# EAGLE design VideoMacPac_adapter (EAGLE 6.5.0)
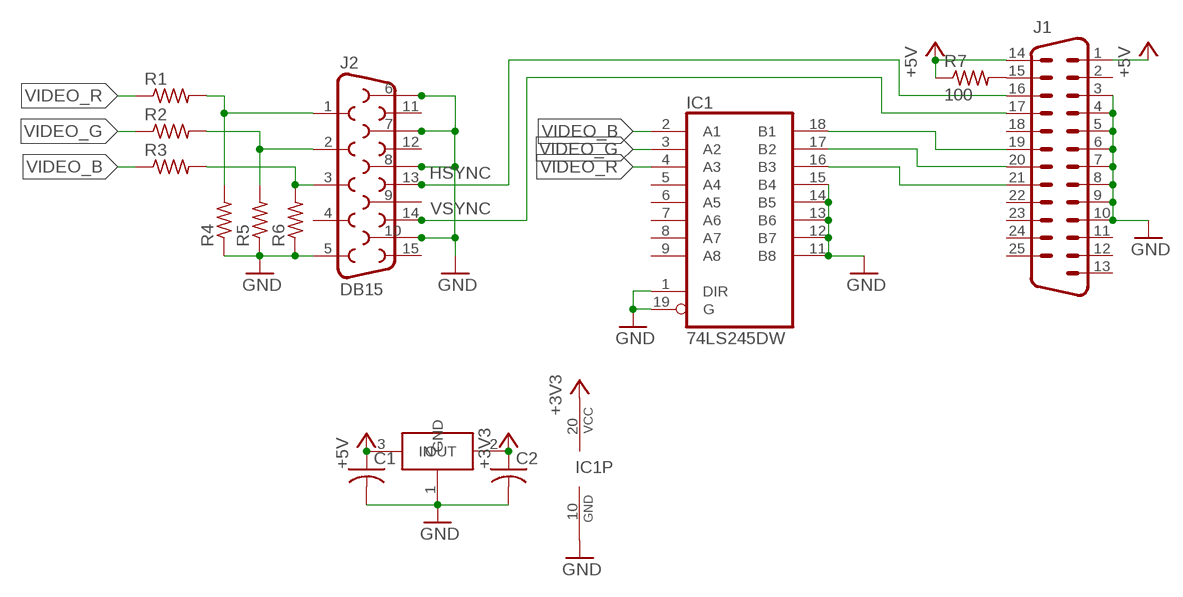
[diagram p0: schematic, sheet 1]

## Parts
C1  C-USC0603  [C0603]
C2  C-USC0603  [C0603]
IC1  74LS245DW  [SO20W]
IC2  MCP1700  [SOT23]
J1  DB25H  [M25H]
J2  DB15  [DB15]
R1  R-US_R0603  [R0603]
R2  R-US_R0603  [R0603]
R3  R-US_R0603  [R0603]
R4  R-US_R0603  [R0603]
R5  R-US_R0603  [R0603]
R6  R-US_R0603  [R0603]
R7  100  R-US_R0603  [R0603]

## Nets
+3V3: C2.1 IC1.20(VCC) IC2.2(OUT)
+5V: C1.1 IC2.3(IN) J1.1 J1.14 R7.1
GND: C1.2 C2.2 IC1.1(DIR) IC1.10(GND) IC1.11(B8) IC1.12(B7) IC1.13(B6) IC1.14(B5) IC1.15(B4) IC1.19(G) IC2.1(GND) J1.3 J1.4 J1.5 J1.6 J1.7 J1.8 J1.9 J1.10 J2.5 J2.6 J2.7 J2.8 J2.10 R4.1 R5.1 R6.1
HSYNC: J1.16 J2.13
N$1: J1.15 R7.2
N$2: IC1.16(B3) J1.21
N$3: J2.3 R3.2 R6.2
N$5: IC1.17(B2) J1.20
N$6: J2.2 R2.2 R5.2
N$7: J2.1 R1.2 R4.2
N$9: IC1.18(B1) J1.19
VIDEO_B: IC1.2(A1) R3.1
VIDEO_G: IC1.3(A2) R2.1
VIDEO_R: IC1.4(A3) R1.1
VSYNC: J1.17 J2.14
Unconnected: IC1.5(A4) IC1.6(A5) IC1.7(A6) IC1.8(A7) IC1.9(A8) J1.2 J1.11 J1.12 J1.13 J1.18 J1.22 J1.23 J1.24 J1.25 J2.4 J2.9 J2.11 J2.12 J2.15

## Library data of the parts
C1 C2 = resistor:C-US: CAPACITOR, American symbol
IC1 = 74xx-us:74*245: Octal BUS TRANSCEIVER, 3-state
IC2 = custom:MCP1700
J1 = SparkFun-Connectors:DB25: Various DB25 connectors
J2 = SparkFun-Connectors:DB15: DB15 / VGA right angle through-hole female connector.
R1-R7 = resistor:R-US_: RESISTOR, American symbol

## Board
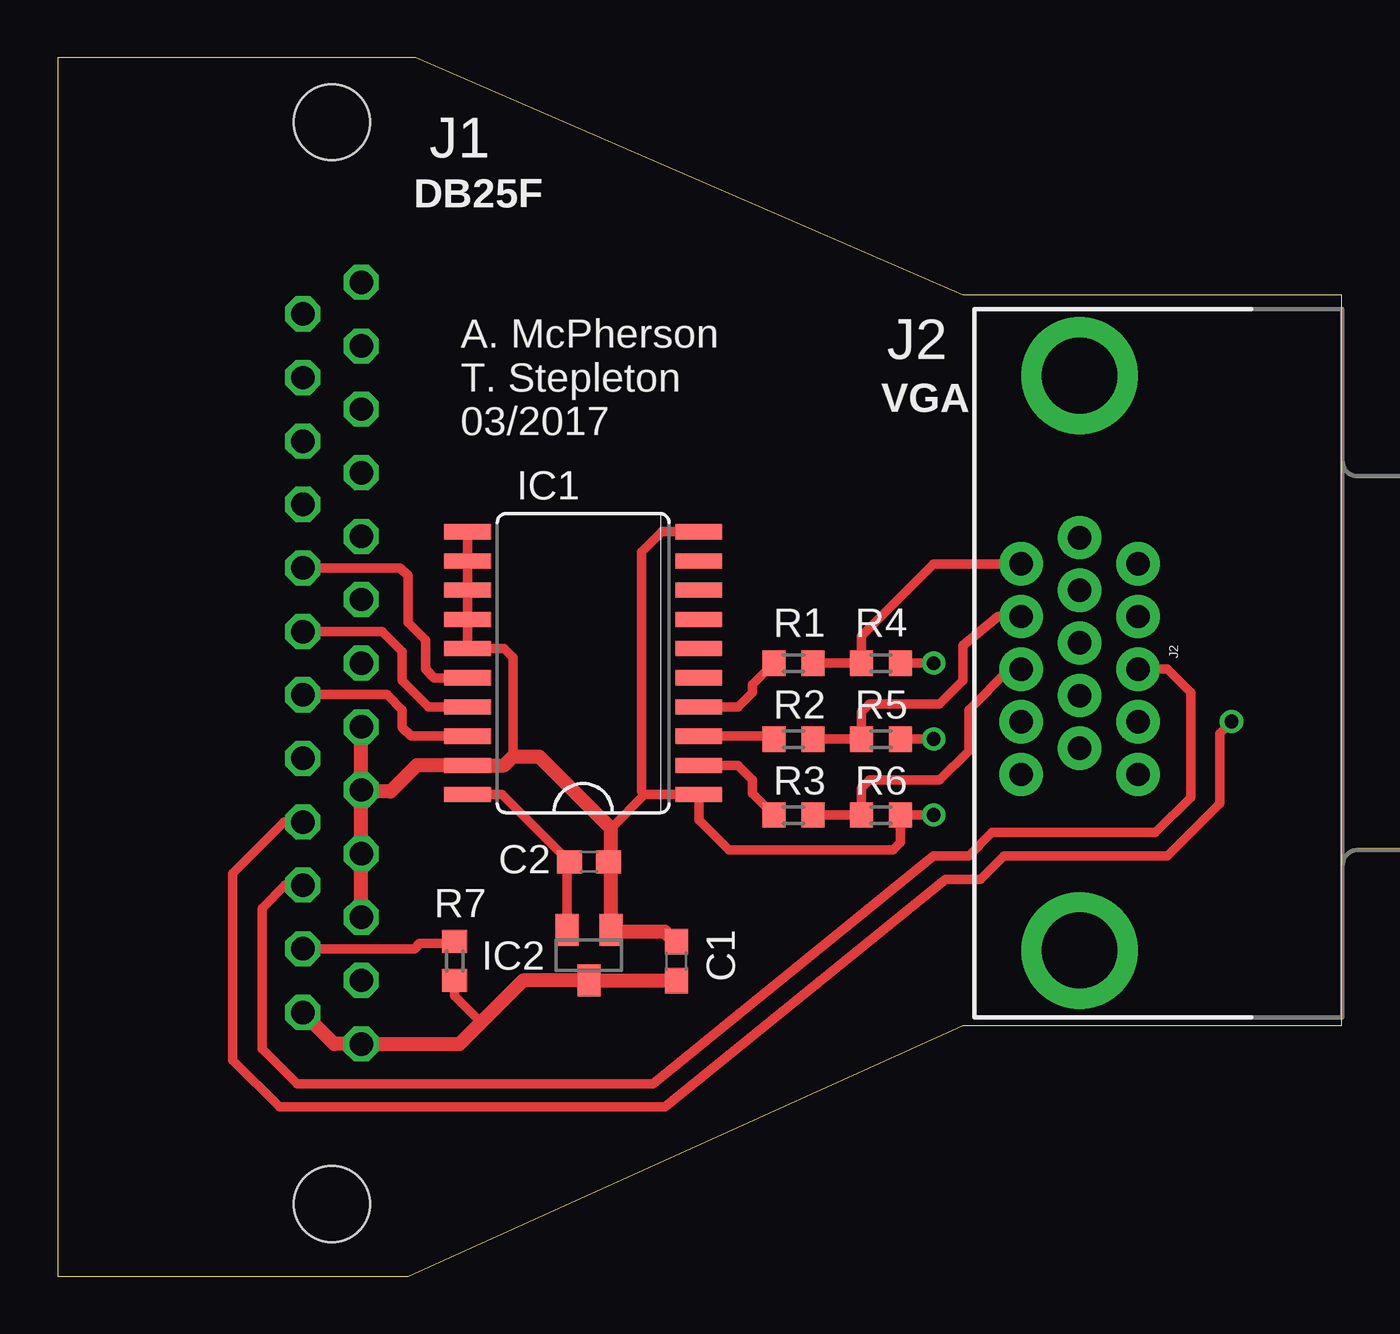
[diagram p1: board, top side]
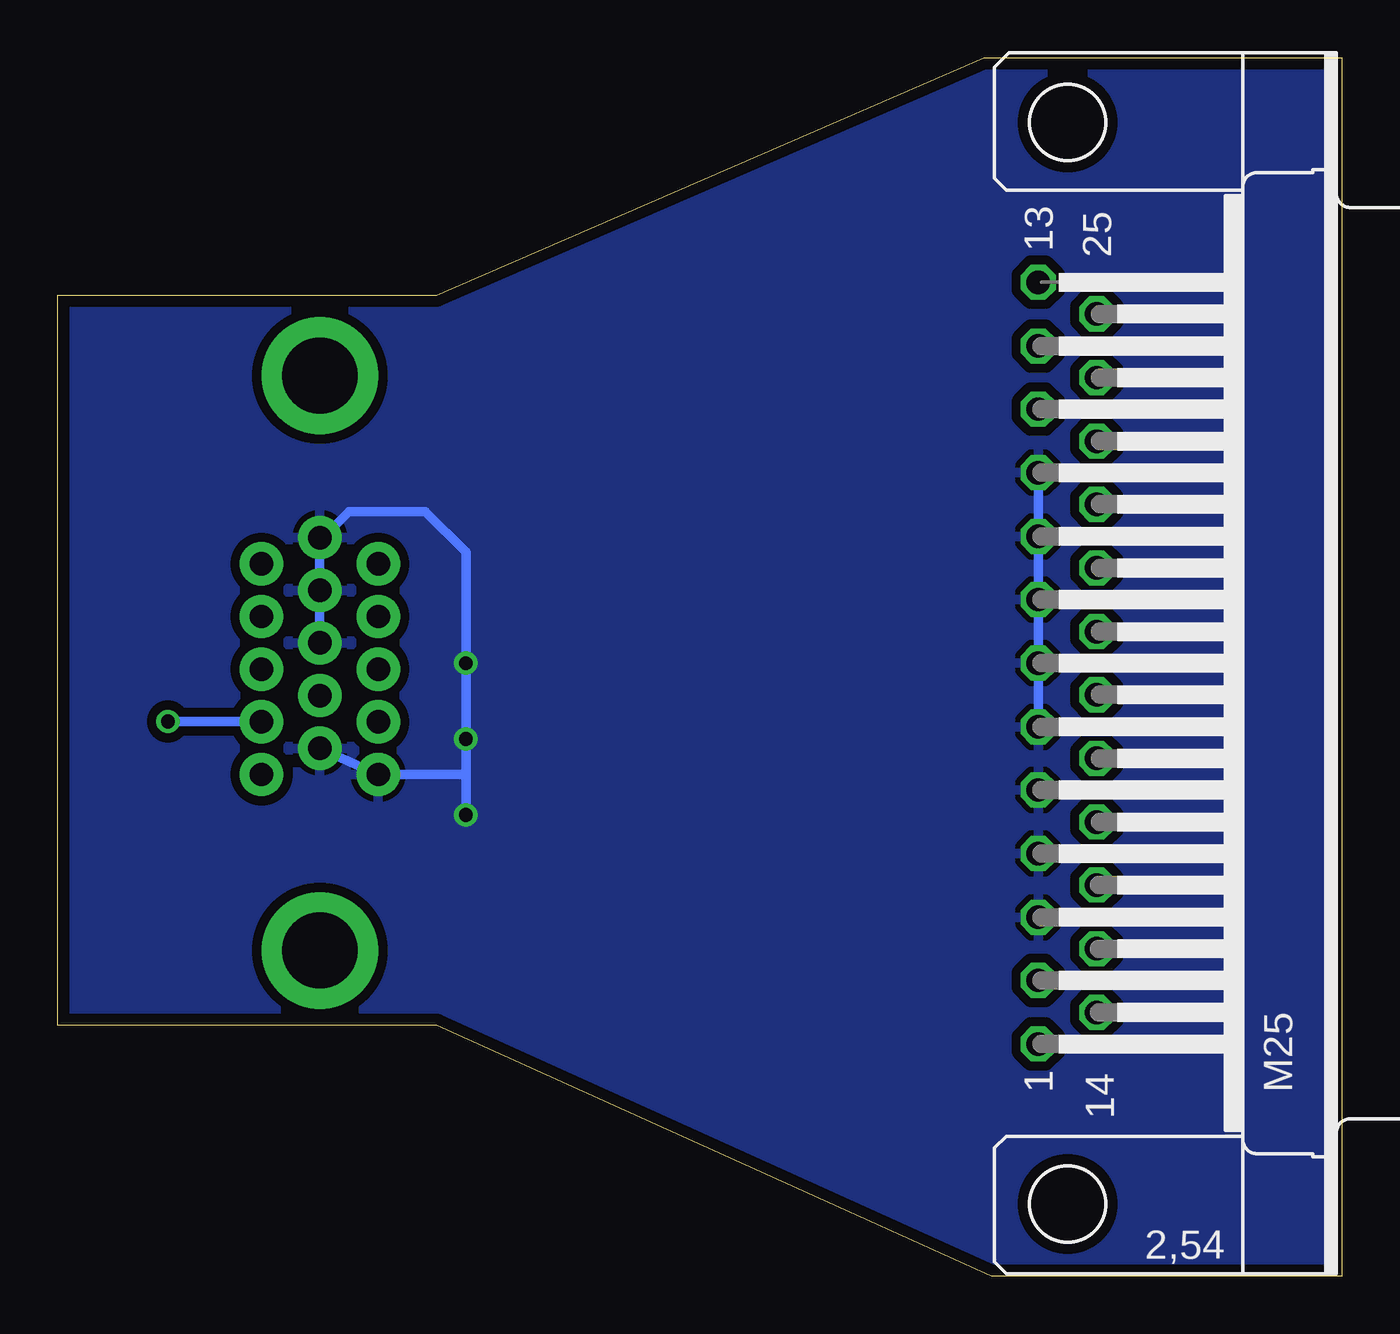
[diagram p2: board, bottom side, seen from below]

Size 55.86 x 53.01 mm. Coordinates in mm from the lower left corner, seen from the top.
Outline: 0,0 15.24,0 39.37,10.92 55.86,10.92 55.86,42.67 39.37,42.67 15.57,53.01 0,53.01 0,0
Copper layers (1*16): Top 0.035mm / dielectric 1.5mm / Bottom 0.035mm
Design rules "default *": minimum track width 10mil, minimum drill 23mil, track to track 10mil, track to pad 10mil, pad to pad 10mil, via to via 10mil, smd to smd 0mil, copper to edge 20mil, drill to drill 8mil, minimum pad ring 10mil, minimum via ring 8mil, stop-mask expansion 4mil, vias tented up to drill 0mil, thermal gap 10mil

### Footprints (pad centres in the part's own frame; a part is rotated, then mirrored left to right if it is on the bottom)
C0603 = smd 1.1 x 1: 1 -0.85,0; 2 0.85,0
SO20W = smd 0.66 x 2.032: 1 -5.715,-5.029; 2 -4.445,-5.029; 3 -3.175,-5.029; 4 -1.905,-5.029; 5 -0.635,-5.029; 6 0.635,-5.029; 7 1.905,-5.029; 8 3.175,-5.029; 9 4.445,-5.029; 10 5.715,-5.029; 11 5.715,5.029; 12 4.445,5.029; 13 3.175,5.029; 14 1.905,5.029; 15 0.635,5.029; 16 -0.635,5.029; 17 -1.905,5.029; 18 -3.175,5.029; 19 -4.445,5.029; 20 -5.715,5.029
SOT23 = smd 1 x 1.4: 1 -0.95,-1.1; 2 0.95,-1.1; 3 0,1.1
M25H = drill 1.016 octagon: 1 -16.561,1.27; 2 -13.792,1.27; 3 -11.049,1.27; 4 -8.28,1.27; 5 -5.512,1.27; 6 -2.769,1.27; 7 0,1.27; 8 2.769,1.27; 9 5.512,1.27; 10 8.28,1.27; 11 11.049,1.27; 12 13.792,1.27; 13 16.561,1.27; 14 -15.189,-1.27; 15 -12.421,-1.27; 16 -9.652,-1.27; 17 -6.909,-1.27; 18 -4.14,-1.27; 19 -1.372,-1.27; 20 1.372,-1.27; 21 4.14,-1.27; 22 6.909,-1.27; 23 9.652,-1.27; 24 12.421,-1.27; 25 15.189,-1.27 | hole 3.302: 23.52,0; -23.52,0
DB15 = drill 1.016 pad 1.88: 1 -4.32,-7.62; 2 -2.03,-7.62; 3 0.26,-7.62; 4 2.55,-7.62; 5 4.84,-7.62; 6 -5.46,-5.08; 7 -3.17,-5.08; 8 -0.88,-5.08; 9 1.41,-5.08; 10 3.7,-5.08; 11 -4.32,-2.54; 12 -2.03,-2.54; 13 0.26,-2.54; 14 2.55,-2.54; 15 4.84,-2.54 | drill 3.302 pad 5.08: G1 -12.5,-5.08; G2 12.5,-5.08
R0603 = smd 1 x 1.1: 1 -0.85,0; 2 0.85,0

### Placement (x,y rotation side)
C1  26.92,13.72 90 top
C2  23.11,18.03 0 top
IC1  22.86,26.67 90 top
IC2  23.11,13.97 180 top
J1  11.94,26.67 90 bottom
J2  49.53,26.67 270 top
R1  32,26.67 0 top
R2  32,23.37 0 top
R3  32,20.07 0 top
R4  35.81,26.67 180 top
R5  35.81,23.37 180 top
R6  35.81,20.07 180 top
R7  17.27,13.72 90 top

### Tracks (layer width: path | path; a pad name or v marks a point on that pad's centre or on a via)
+3V3
  Top 0.406: IC1.20 19.34,20.95 C2.1 22.16,17.93 IC2.2
+5V
  Top 0.406: C1.1 | R7.1 17.27,12.19 18.41,11.05
  Top 0.61: C1.1 IC2.3 20.24,12.87 18.41,11.05 17.48,10.11 J1.1 12.04,10.11 J1.14
GND  (via drill 0.6)
  Top 0.406: IC1.11 IC1.12 IC1.13 IC1.14 IC1.15 19.43,27.3 19.81,26.92 19.81,22.61 | 24.06,17.93 C2.2 | C1.2 26.84,14.57 | 24.15,14.99 IC2.1 | 24.06,19.49 25.53,20.95 | 25.53,20.95 IC1.1 27.89,19.86 29.21,18.54 36.32,18.54 36.66,18.88 R6.1 v38.1,20.07 | IC1.10 26.29,32.38 25.4,31.5 25.4,21.08 25.53,20.95 | R5.1 v38.1,23.37 | R4.1 v38.1,26.67 | 13.28,21.08 J1.5
  Top 0.61: IC2.1 24.06,17.93 24.06,19.49 20.95,22.61 19.81,22.61 19.43,22.23 IC1.19 15.62,22.23 14.48,21.08 13.28,21.08 | 26.84,14.57 26.42,14.99 24.15,14.99 | J1.6 J1.5 J1.4 J1.3
  Bottom 0.406: 38.1,21.84 v38.1,23.37 v38.1,26.67 38.1,31.5 39.88,33.27 43.18,33.27 44.45,32 J2.8 J2.7 J2.6 | 38.1,21.84 v38.1,20.07 | J2.10 J2.5 38.11,21.83 38.1,21.84 | J1.10 J1.9 J1.8 J1.7 J1.6
  pour Bottom (isolate 0.406): 0,0 55.88,0 55.88,54.1 0,54.1
HSYNC
  Top 0.406: J1.16 9.91,17.02 8.89,16 8.89,9.91 10.41,8.38 25.91,8.38 38.1,18.29 39.62,18.29 40.64,19.3 47.75,19.3 49.28,20.83 49.28,25.4 48.26,26.42 J2.13
N$1
  Top 0.406: J1.15 15.52,14.25 15.75,14.48 17.18,14.48 R7.2
N$2
  Top 0.406: IC1.16 16.38,26.04 16,26.42 16,27.69 15.24,28.45 15.24,30.48 14.91,30.81 J1.21
N$3
  Top 0.406: R3.2 R6.2 34.96,21.25 35.31,21.59 38.35,21.59 39.62,22.86 39.62,24.64 41.4,26.42 41.41,26.42 J2.3
N$5
  Top 0.406: J1.20 14.12,28.04 14.99,27.18 14.99,25.91 16.13,24.76 IC1.17
N$6
  Top 0.406: R2.2 R5.2 34.96,24.55 35.31,24.89 38.35,24.89 39.37,25.91 39.37,27.43 40.89,28.7 J2.2
N$7
  Top 0.406: R1.2 R4.2 34.96,27.85 38.1,30.99 J2.1
N$9
  Top 0.406: J1.19 14.33,25.3 14.99,24.64 14.99,23.88 15.37,23.49 IC1.18
VIDEO_B
  Top 0.406: IC1.2 29.59,22.23 30.23,21.59 30.23,20.99 R3.1
VIDEO_G
  Top 0.254: 31.03,23.49 R2.1
  Top 0.406: IC1.3 31.03,23.49
VIDEO_R
  Top 0.406: IC1.4 29.59,24.76 30.23,25.4 30.23,25.74 R1.1
VSYNC  (via drill 0.6)
  Top 0.406: J1.17 9.86,19.76 7.62,17.53 7.62,9.4 9.65,7.37 26.42,7.37 38.61,17.27 40.13,17.27 41.15,18.29 48.26,18.29 50.55,20.57 50.55,23.62 v51.05,24.13
  Bottom 0.406: v51.05,24.13 J2.14

### Text on the board
tPlace: DB25F | VGA | A. McPherson / T. Stepleton / 03/2017
tNames: J2